# Altium schematic sheet 5VBulkhead.SchDoc
size A4
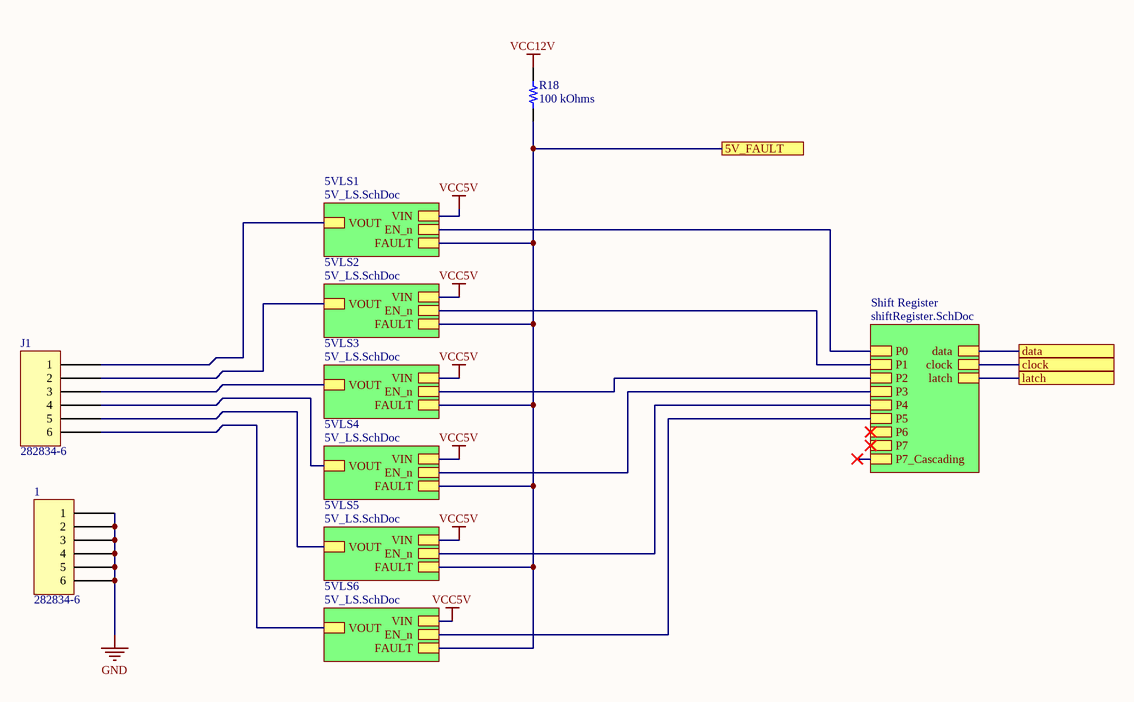
[diagram p0: 5VBulkhead.SchDoc]

## Parts
1  282834-6  [TE 282834-6]
J1  282834-6  [TE 282834-6]
R18  100 kOhms  [RES 0603_1608]

## Sub-sheets
5VLS1 = 5V_LS.SchDoc: VIN, VOUT, EN_n, FAULT
5VLS2 = 5V_LS.SchDoc: VIN, VOUT, EN_n, FAULT
5VLS3 = 5V_LS.SchDoc: VIN, VOUT, EN_n, FAULT
5VLS4 = 5V_LS.SchDoc: VIN, VOUT, EN_n, FAULT
5VLS5 = 5V_LS.SchDoc: VIN, VOUT, EN_n, FAULT
5VLS6 = 5V_LS.SchDoc: VIN, VOUT, EN_n, FAULT
Shift Register = shiftRegister.SchDoc: P0, P1, P2, P3, P4, P5, P6, P7, P7_Cascading, data, clock, latch

## Ports
5V_FAULT, clock, data, latch

## Nets
GND: 1.1 1.2 1.3 1.4 1.5 1.6
VCC5V: sheet 5VLS1/VIN, sheet 5VLS2/VIN, sheet 5VLS3/VIN, sheet 5VLS4/VIN, sheet 5VLS5/VIN, sheet 5VLS6/VIN
VCC12V: R18.2
5V_FAULT: R18.1 ; port 5V_FAULT, sheet 5VLS1/FAULT, sheet 5VLS2/FAULT, sheet 5VLS3/FAULT, sheet 5VLS4/FAULT, sheet 5VLS5/FAULT, sheet 5VLS6/FAULT
clock: port clock, sheet Shift Register/clock
data: port data, sheet Shift Register/data
latch: port latch, sheet Shift Register/latch
NetJ1_1: J1.1 ; sheet 5VLS1/VOUT
NetJ1_2: J1.2 ; sheet 5VLS2/VOUT
NetJ1_3: J1.3 ; sheet 5VLS3/VOUT
NetJ1_4: J1.4 ; sheet 5VLS4/VOUT
NetJ1_5: J1.5 ; sheet 5VLS5/VOUT
NetJ1_6: J1.6 ; sheet 5VLS6/VOUT
(unnamed): sheet Shift Register/P0, sheet 5VLS1/EN_n
(unnamed): sheet Shift Register/P1, sheet 5VLS2/EN_n
(unnamed): sheet Shift Register/P2, sheet 5VLS3/EN_n
(unnamed): sheet Shift Register/P3, sheet 5VLS4/EN_n
(unnamed): sheet Shift Register/P4, sheet 5VLS5/EN_n
(unnamed): sheet Shift Register/P5, sheet 5VLS6/EN_n

## Library data of the parts
1 J1 = 282834-6: TERM BLK 6P SIDE ENT 2.54MM PCB; Manufacturer: TE Connectivity AMP Connectors; Current: 10A; Mating Orientation: Horizontal with Board; Number of Levels: 1; Pitch: 0.100" (2.54mm); Positions Per Level: 6; Voltage: 150V; Wire Gauge: 16-30 AWG; Wire Termination: Screw - Rising Cage Clamp; Part Number: 282834-6; Color: Green; ComponentLink1Description: Datasheet; ComponentLink1URL: https://www.te.com/commerce/DocumentDelivery/DDEController?Action=srchrtrv&DocNm=282834&DocType=Customer+Drawing&DocLang=English; ComponentLink2Description: DigiKey Link; ComponentLink2URL: http://digikey.com/product-detail/en/te-connectivity-amp-connectors/282834-6/A98337-ND/1153267; LastUpdated: 2020-01-15 4:16:31 AM; Lifecycle Status: Active; Minimum Order: 1; Mounting Type: Through Hole; Packaging: Bulk; Part Status: Active; Price: 4.72; Series: Buchanan; Supplier 1: DigiKey; Supplier Part Number 1: A98337-ND
R18 = RNCS0603BKE100K: RES 100K OHM 0.1% 1/16W 0603; Manufacturer: Stackpole Electronics Inc; Power (Watts): 0.063W, 1/16W; Temperature Coefficient: ±25ppm/°C; Part Number: RNCS0603BKE100K; Value: 100 kOhms; ComponentLink1Description: Datasheet; ComponentLink1URL: https://www.seielect.com/catalog/sei-rncs_rnch.pdf; ComponentLink2Description: DigiKey Link; ComponentLink2URL: https://www.digikey.com/en/products/detail/stackpole-electronics-inc/RNCS0603BKE100K/1708835; Composition: Thin Film; Device Package: 0603 (1608 Metric); Features: Anti-Corrosive, Automotive AEC-Q200, Moisture Resistant; Height - Seated (Max): 0.022" (0.55mm); LastUpdated: 2023-06-08 7:45:17 PM; Lifecycle Status: Active; Minimum Order: 1; Number of Terminations: 2; Operating Temperature: -55°C ~ 155°C; Package / Case: 0603 (1608 Metric); Packaging: TapeAndReel; PartId: 4849; Part Status: Active; Price: 0.07; Ratings: AEC-Q200; Resistance: 100 kOhms; Series: RNCS; Size / Dimension: 0.061" L x 0.031" W (1.55mm x 0.80mm); Supplier 1: DigiKey; Supplier Part Number 1: RNCS0603BKE100KCT-ND; Supplier Device Package: 0603; Tolerance: ±0.1%